# Altium schematic sheet Smart Stepper Fin - MCU MKL05Z32VLF4 TQFP48 .SchDoc
size A
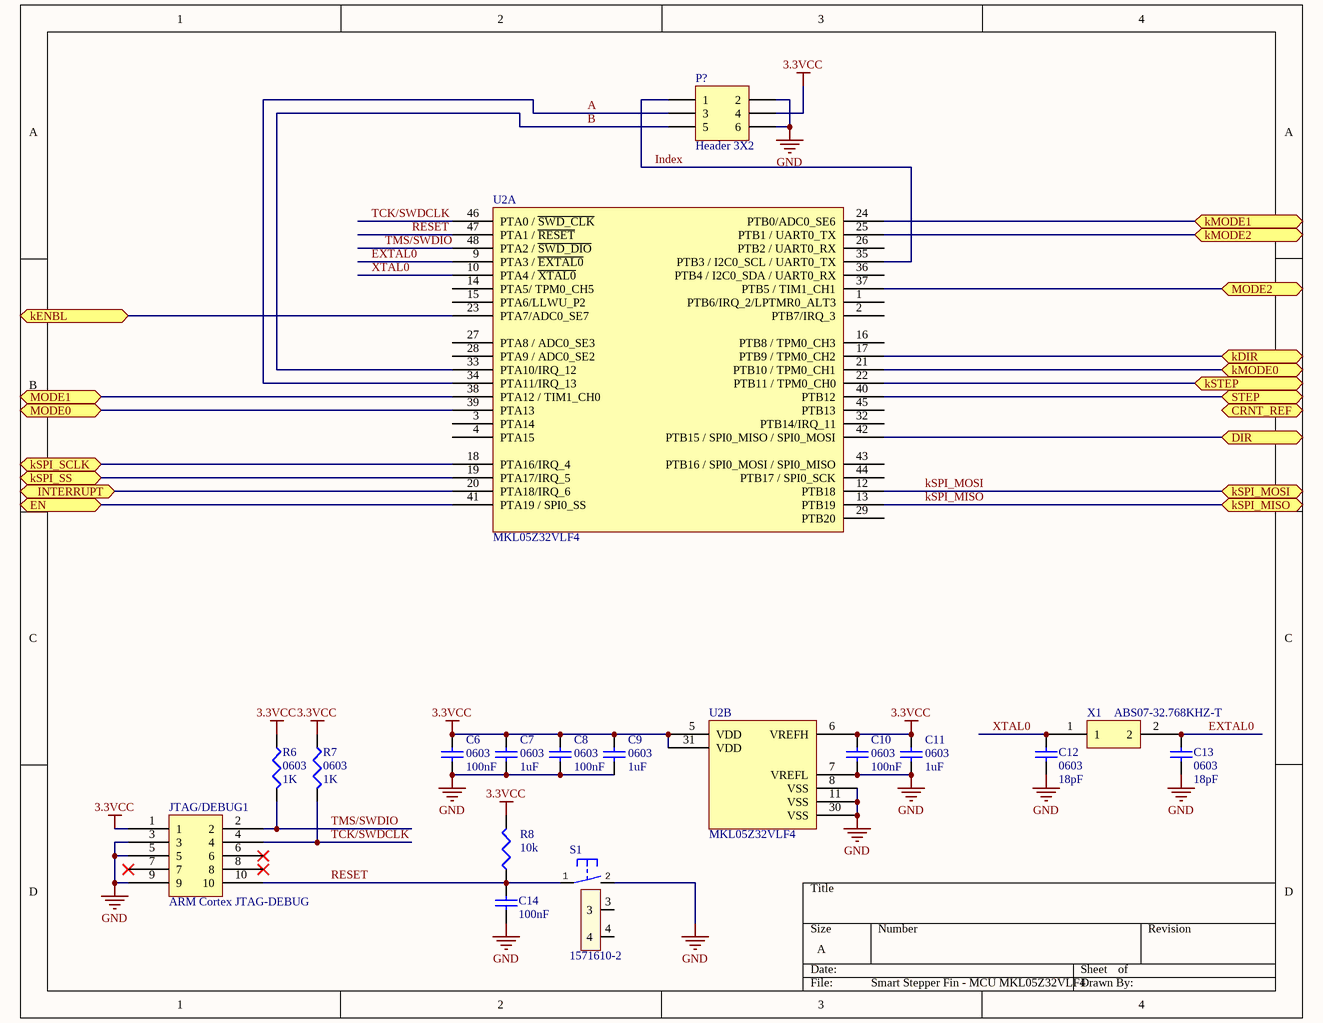
[diagram p0: Smart Stepper Fin - MCU MKL05Z32VLF4 TQFP48 .SchDoc]

## Parts
C6  0603  value 100nF  [1608[0603]]
C7  0603  value 1uF  [1608[0603]]
C8  0603  value 100nF  [1608[0603]]
C9  0603  value 1uF  [1608[0603]]
C10  0603  value 100nF  [1608[0603]]
C11  0603  value 1uF  [1608[0603]]
C12  0603  value 18pF  [1608[0603]]
C13  0603  value 18pF  [1608[0603]]
C14  value 100nF  [1608[0603]]  (hidden comment: Cap Semi)
JTAG/DEBUG1  ARM Cortex JTAG-DEBUG  [FTSH-105-XX-X-DV]
P?  Header 3X2  [HDR2X3 Shrouded - Molex 0901301106]
R6  0603  value 1K  [J1-0603]
R7  0603  value 1K  [J1-0603]
R8  value 10k  [J1-0603]  (hidden comment: Res3)
S1  1571610-2  [B3F-31XX]
U2  MKL05Z32VLF4  [MKL05Z32VLF4]  (parts A,B of 2)
X1  ABS07-32.768KHZ-T  [ABS07-32.768KHZ-T]

## Ports
CRNT_REF, DIR, EN, INTERRUPT, kDIR, kENBL, kMODE0, kMODE1, kMODE2, kSPI_MISO, kSPI_MOSI, kSPI_SCLK, kSPI_SS, kSTEP, MODE0, MODE1, MODE2, STEP

## Nets
3.3VCC: C6.2 C7.2 C8.2 C9.2 C10.1 C11.1 JTAG/DEBUG1.1 P?.4 R6.1 R7.1 R8.2 U2.5(VDD) U2.6(VREFH) U2.31(VDD)
GND: C6.1 C7.1 C8.1 C9.1 C10.2 C11.2 C12.2 C13.2 C14.1 JTAG/DEBUG1.3 JTAG/DEBUG1.5 JTAG/DEBUG1.9 P?.2 P?.6 S1.2(S) U2.7(VREFL) U2.8(VSS) U2.11(VSS) U2.30(VSS)
A: P?.3 U2.34(PTA11/IRQ_13)
B: P?.5 U2.33(PTA10/IRQ_12)
DIR: U2.42(PTB15_/_SPI0_MISO_/_SPI0_MOSI) ; port DIR
EN: U2.41(PTA19_/_SPI0_SS) ; port EN
EXTAL0: C13.1 U2.9(PTA3_/_~{EXTAL0}) X1.2
Index: P?.1 U2.35(PTB3_/_I2C0_SCL_/_UART0_TX)
INTERRUPT: U2.20(PTA18/IRQ_6) ; port INTERRUPT
kDIR: U2.17(PTB9_/_TPM0_CH2) ; port kDIR
kENBL: U2.23(PTA7/ADC0_SE7) ; port kENBL
kMODE0: U2.21(PTB10_/_TPM0_CH1) ; port kMODE0
kMODE1: U2.24(PTB0/ADC0_SE6) ; port kMODE1
kMODE2: U2.25(PTB1_/_UART0_TX) ; port kMODE2
kSPI_MISO: U2.13(PTB19) ; port kSPI_MISO
kSPI_MOSI: U2.12(PTB18) ; port kSPI_MOSI
kSPI_SCLK: U2.18(PTA16/IRQ_4) ; port kSPI_SCLK
kSPI_SS: U2.19(PTA17/IRQ_5) ; port kSPI_SS
kSTEP: U2.22(PTB11_/_TPM0_CH0) ; port kSTEP
MODE0: U2.39(PTA13) ; port MODE0
MODE1: U2.38(PTA12_/_TIM1_CH0) ; port MODE1
MODE2: U2.37(PTB5_/_TIM1_CH1) ; port MODE2
RESET: C14.2 JTAG/DEBUG1.10 R8.1 S1.1(P) U2.47(PTA1_/_~{RESET})
STEP: U2.40(PTB12) ; port STEP
TCK/SWDCLK: JTAG/DEBUG1.4 R7.2 U2.46(PTA0_/_~{SWD_CLK})
TMS/SWDIO: JTAG/DEBUG1.2 R6.2 U2.48(PTA2_/_~{SWD_DIO})
XTAL0: C12.1 U2.10(PTA4_/_~{XTAL0}) X1.1

Not connected (* = marked no-connect by the designer): JTAG/DEBUG1 6* 7* 8*; S1 3 4; U2 1(PTB6/IRQ_2/LPTMR0_ALT3) 2(PTB7/IRQ_3) 3(PTA14) 4(PTA15) 14(PTA5/_TPM0_CH5) 15(PTA6/LLWU_P2) 16(PTB8_/_TPM0_CH3) 26(PTB2_/_UART0_RX) 27(PTA8_/_ADC0_SE3) 28(PTA9_/_ADC0_SE2) 29(PTB20) 32(PTB14/IRQ_11) 36(PTB4_/_I2C0_SDA_/_UART0_RX) 43(PTB16_/_SPI0_MOSI_/_SPI0_MISO) 44(PTB17_/_SPI0_SCK) 45(PTB13)

## Library data of the parts
C6-C14 = Cap Semi: Capacitor (Semiconductor SIM Model); Published: 8-Jun-2000; LatestRevisionDate: 29-May-2009; LatestRevisionNote: IPC-7351 Footprint Added.; PackageReference: C1206; Publisher: Altium Limited; PackageDescription: Chip Capacitor
JTAG/DEBUG1 = ARM Cortex JTAG-DEBUG Header
P? = Header 3X2: Header, 3-Pin, Dual row; LatestRevisionDate: 17-Jul-2002; LatestRevisionNote: Re-released for DXP Platform.; Publisher: Altium Limited
R6-R8 = Res3: Resistor; Published: 8-Jun-2000; LatestRevisionDate: 29-May-2009; LatestRevisionNote: IPC-7351 Footprint Added.; PackageReference: J1-0603; Publisher: Altium Limited; PackageDescription: Chip Resistor
S1 = 1571610-2_1: SWTCH Momentary Washable; Manufacturer: Omron; Manufacturer: TE; LastRevisionNote: Import; ComponentLink1URL: http://www.te.com/commerce/DocumentDelivery/DDEController?Action=srchrtrv&DocNm=1571610&DocType=Customer+Drawing&DocLang=English; ComponentLink1Description: Datasheet for B3F-31XX; Published: 23-Apr-2014; Publisher: UltiMachine; LastRevisionDate: 23-Apr-2014; ManufacturerPartNumber: 1571610-2; Supplier 1: Mouser; Supplier Part Number 1: 506-1571610-2
U2 = MKL05Z32VLF4: ARM Cortex M0+
X1 = ABS07-32.768KHZ-T: ABS07-32.768KHZ-T RTC Crystal Oscillator